# EAGLE design pro_mini_CAN (EAGLE 6.4)
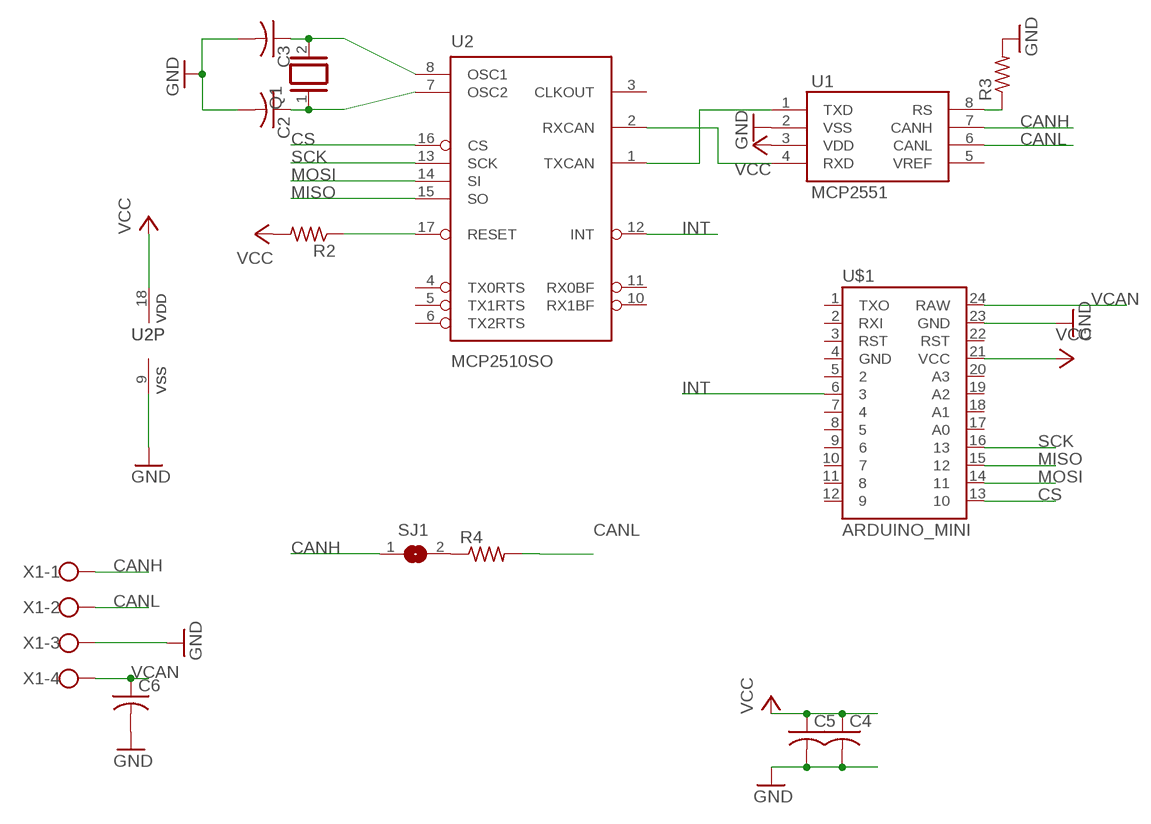
[diagram p0: schematic, sheet 1]

## Parts
C2  C-USC0805K  [C0805K]
C3  C-USC0805K  [C0805K]
C4  C-USC0805K  [C0805K]
C5  C-USC0805K  [C0805K]
C6  C-USC0805K  [C0805K]
Q1  XTAL/S  [QS]
R2  R-US_R0805  [R0805]
R3  R-US_R0805  [R0805]
R4  R-US_R0805  [R0805]
SJ1  SJ  [SJ]
U1  MCP2551  [SO08]
U2  MCP2510SO  [SO-18W]
U$1  ARDUINO_MINI  [ARDUINO_MINI]
X1  W237-4  [W237-4]

## Nets
CANH: SJ1.1 U1.7(CANH) X1.1
CANL: R4.2 U1.6(CANL) X1.2
CS: U2.16(CS) U$1.13
GND: C2.2 C3.2 C4.2 C5.2 C6.2 R3.2 U1.2(VSS) U2.9(VSS) U$1.23(GND) X1.3
INT: U2.12(INT) U$1.6
MISO: U2.15(SO) U$1.15
MOSI: U2.14(SI) U$1.14
N$1: C3.1 Q1.2 U2.8(OSC1)
N$2: C2.1 Q1.1 U2.7(OSC2)
N$3: U1.1(TXD) U2.1(TXCAN)
N$4: U1.4(RXD) U2.2(RXCAN)
N$5: R2.1 U2.17(RESET)
N$6: R3.1 U1.8(RS)
N$7: R4.1 SJ1.2
SCK: U2.13(SCK) U$1.16
VCAN: C6.1 U$1.24(RAW) X1.4
VCC: C4.1 C5.1 R2.2 U1.3(VDD) U2.18(VDD) U$1.21(VCC)
Unconnected: U1.5(VREF) U2.3(CLKOUT) U2.4(TX0RTS) U2.5(TX1RTS) U2.6(TX2RTS) U2.10(RX1BF) U2.11(RX0BF) U$1.1(TXO) U$1.2(RXI) U$1.3(RST) U$1.4(GND) U$1.5 U$1.7 U$1.8 U$1.9 U$1.10 U$1.11 U$1.12 U$1.17(A0) U$1.18(A1) U$1.19(A2) U$1.20(A3) U$1.22(RST)

## Library data of the parts
C2-C6 = adafruit:C-US: CAPACITOR, American symbol
Q1 = special:XTAL/S: CRYSTAL
R2-R4 = adafruit:R-US_: RESISTOR, American symbol
SJ1 = jumper:SJ: SMD solder JUMPER
U1 = SparkFun-DigitalIC:MCP2551: CAN transceiver; PROD_ID: IC-09907
U2 = SparkFun-DigitalIC:MCP2510: CAN controller with SPI interface to any MCU. Original design by Microchip.; PROD_ID: IC-09906
U$1 = SparkFun-Boards:ARDUINO_MINI: Arduino Pro Mini footprint
X1 = con-wago-500:W237-4: WAGO SCREW CLAMP; OC_FARNELL: unknown; OC_NEWARK: unknown

## Board
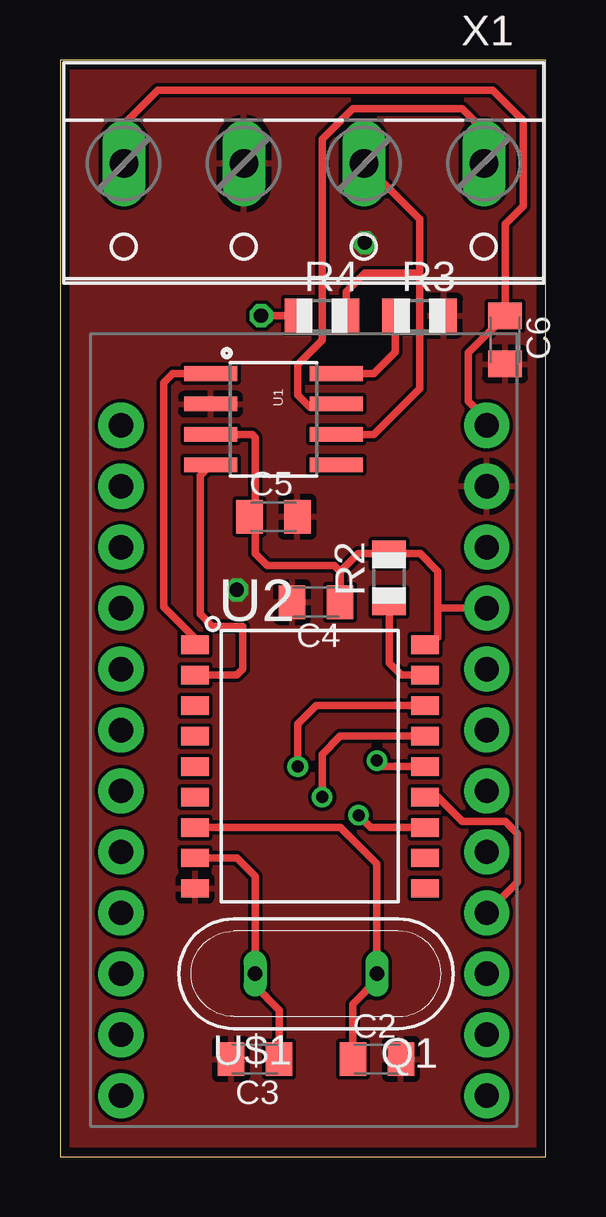
[diagram p1: board, top side]
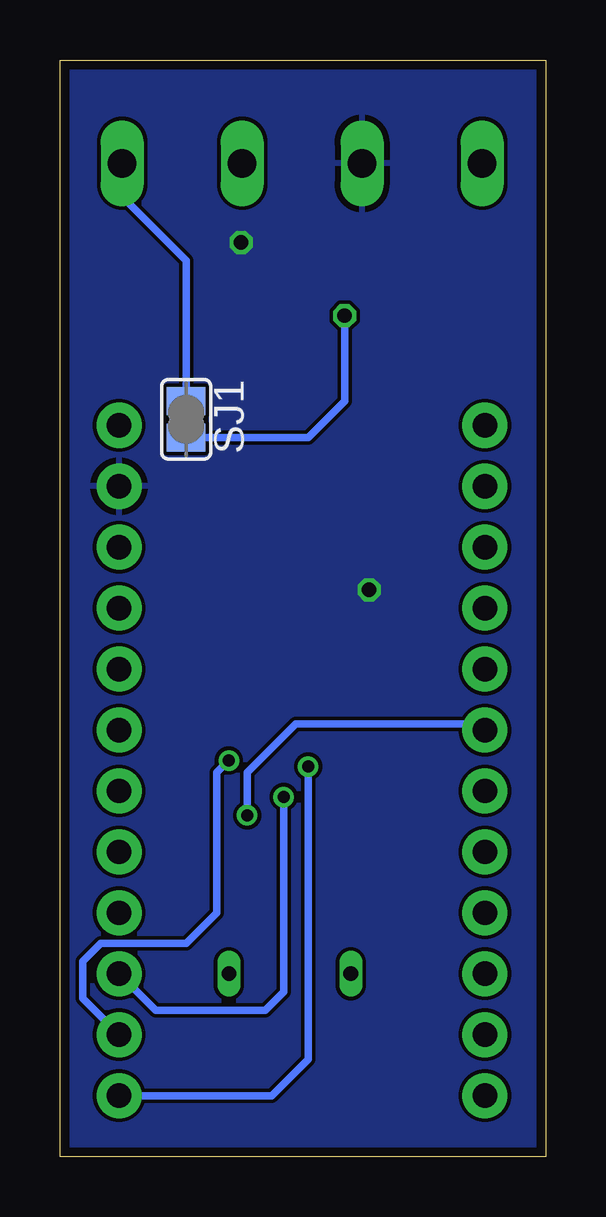
[diagram p2: board, bottom side, seen from below]

Size 20.24 x 45.71 mm. Coordinates in mm from the lower left corner, seen from the top.
Outline: 0,0 20.24,0 20.24,45.71 0,45.71 0,0
Copper layers (1*16): Top 0.0356mm / dielectric 1.5011mm / Bottom 0.0356mm
Design rules "LaenPCBOrder": minimum track width 6mil, minimum drill 13mil, track to track 6mil, track to pad 6mil, pad to pad 6mil, via to via 6mil, smd to smd 6mil, copper to edge 15mil, drill to drill 6mil, minimum pad ring 7mil, minimum via ring 7mil, stop-mask expansion 3mil, vias tented up to drill 0mil, thermal gap 10mil

### Footprints (pad centres in the part's own frame; a part is rotated, then mirrored left to right if it is on the bottom)
C0805K = smd 1.1 x 1.4: 1 -1,0; 2 1,0
QS = drill 0.61 long: 1 -2.54,0; 2 2.54,0
R0805 = smd 1.1 x 1.4: 1 -1,0; 2 1,0
SJ = smd 1.168 x 1.6: 1 -0.762,0; 2 0.762,0
SO08 = smd 0.61 x 2.21: 1 -1.905,-2.616; 2 -0.635,-2.616; 3 0.635,-2.616; 4 1.905,-2.616; 5 1.905,2.616; 6 0.635,2.616; 7 -0.635,2.616; 8 -1.905,2.616
SO-18W = smd 0.762 x 1.143: 1 -5.08,-4.788; 2 -3.81,-4.788; 3 -2.54,-4.788; 4 -1.27,-4.788; 5 0,-4.788; 6 1.27,-4.788; 7 2.54,-4.788; 8 3.81,-4.788; 9 5.08,-4.788; 10 5.08,4.788; 11 3.81,4.788; 12 2.54,4.788; 13 1.27,4.788; 14 0,4.788; 15 -1.27,4.788; 16 -2.54,4.788; 17 -3.81,4.788; 18 -5.08,4.788
ARDUINO_MINI = drill 1.016 pad 1.88: 1 -7.62,12.7; 2 -7.62,10.16; 3 -7.62,7.62; 4 -7.62,5.08; 5 -7.62,2.54; 6 -7.62,0; 7 -7.62,-2.54; 8 -7.62,-5.08; 9 -7.62,-7.62; 10 -7.62,-10.16; 11 -7.62,-12.7; 12 -7.62,-15.24; 13 7.62,-15.24; 14 7.62,-12.7; 15 7.62,-10.16; 16 7.62,-7.62; 17 7.62,-5.08; 18 7.62,-2.54; 19 7.62,0; 20 7.62,2.54; 21 7.62,5.08; 22 7.62,7.62; 23 7.62,10.16; 24 7.62,12.7
W237-4 = drill 1.194 long: 1 -7.5,-1.27; 2 -2.5,-1.27; 3 2.5,-1.27; 4 7.5,-1.27

### Placement (x,y rotation side)
C2  13.21,4.06 0 top
C3  8.13,4.06 180 top
C4  10.67,23.11 180 top
C5  8.89,26.67 0 top
C6  18.54,34.04 270 top
Q1  10.67,7.62 180 top
R2  13.72,24.13 90 top
R3  14.99,35.05 0 top
R4  10.92,35.05 0 top
SJ1  14.99,30.73 270 bottom
U1  8.89,30.73 270 top
U2  10.41,16.26 270 top
U$1  10.16,17.78 0 top
X1  10.16,40.13 180 top

### Tracks (layer width: path | path; a pad name or v marks a point on that pad's centre or on a via)
CANH
  Top 0.305: X1.1 17.66,42.79 16.76,43.69 12.19,43.69 10.92,42.42 10.92,34.04 9.91,33.02 9.91,31.75 10.41,31.24 11.38,31.24 U1.7
  Bottom 0.305: SJ1.1 14.99,37.34 17.78,40.13 17.78,41.28 X1.1
CANL
  Top 0.305: U1.6 13.08,30.1 14.99,32 14.99,36.83 | 14.99,36.83 14.99,39.08 X1.2 | R4.2 11.92,36.05 12.7,36.83 14.99,36.83
CS  (via drill 0.5)
  Top 0.305: 13.72,18.8 U2.16 10.67,18.8 9.91,18.03 v9.91,16.26
  Bottom 0.305: v9.91,16.26 9.91,4.06 11.43,2.54 U$1.13
GND  (via drill 0.6)
  other vias: 7.37,23.62 12.7,38.1
  pour Bottom: -5.08,53.34 27.94,53.34 27.94,-6.35 -5.08,-6.35
  pour Top: -2.54,49.53 24.13,49.53 24.13,-1.27 -2.54,-1.27
INT  (via drill 0.5)
  Top 0.305: U2.12 12.95,13.72 v12.45,14.22
  Bottom 0.305: v12.45,14.22 12.45,16 10.41,18.03 2.79,18.03 U$1.6
MISO  (via drill 0.5)
  Top 0.305: U2.15 11.68,17.53 10.92,16.76 v10.92,14.99
  Bottom 0.305: v10.92,14.99 10.92,6.86 11.68,6.1 16.26,6.1 U$1.15
MOSI  (via drill 0.5)
  Top 0.305: U2.14 13.46,16.26 v13.21,16.51
  Bottom 0.305: U$1.14 19.3,6.6 19.3,8.13 18.54,8.89 14.99,8.89 13.72,10.16 13.72,16 v13.21,16.51
N$1
  Top 0.305: U2.8 7.37,12.45 8.13,11.68 Q1.2 8.13,7.11 9.14,6.1 9.14,4.08 C3.1
N$2
  Top 0.305: U2.7 11.68,13.72 13.21,12.19 Q1.1 13.21,7.37 12.19,6.35 12.19,4.08 C2.1
N$3
  Top 0.305: U1.1 4.7,32.64 4.32,32.26 4.32,22.9 5.63,21.59 U2.1
N$4
  Top 0.305: U2.2 7.37,20.07 7.62,20.32 7.62,22.1 6.35,22.1 5.84,22.61 5.84,28.4 U1.4
N$5
  Top 0.305: R2.1 13.72,20.57 14.22,20.07 U2.17
N$6
  Top 0.305: U1.8 13.08,32.64 13.97,33.53 13.97,35.04 R3.1
N$7  (via drill 0.6)
  Top 0.305: v8.38,35.05 R4.1
  Bottom 0.305: SJ1.2 9.91,29.97 8.38,31.5 v8.38,35.05
SCK
  Top 0.305: U2.13 15.75,14.99 16.76,13.97 18.54,13.97 19.05,13.46 19.05,11.43 U$1.16
VCAN
  Top 0.305: X1.4 2.79,41.54 2.79,43.18 4.06,44.45 18.03,44.45 19.3,43.18 19.3,39.62 18.54,38.86 C6.1 17.02,33.51 17.02,31.5 17.78,30.73 U$1.24
VCC
  Top 0.305: U1.3 8,30.1 8.13,29.97 8.13,26.91 | 8.13,26.91 C5.1 | 11.68,23.11 C4.1 11.68,23.13 11.68,24.38 | 15.75,22.86 15.75,21.63 U2.18 | U$1.21 15.75,22.86 | 11.68,24.38 12.43,25.13 R2.2 15,25.13 15.75,24.38 15.75,22.86 | 8.13,26.91 8.13,25.15 8.64,24.64 11.43,24.64 11.68,24.38